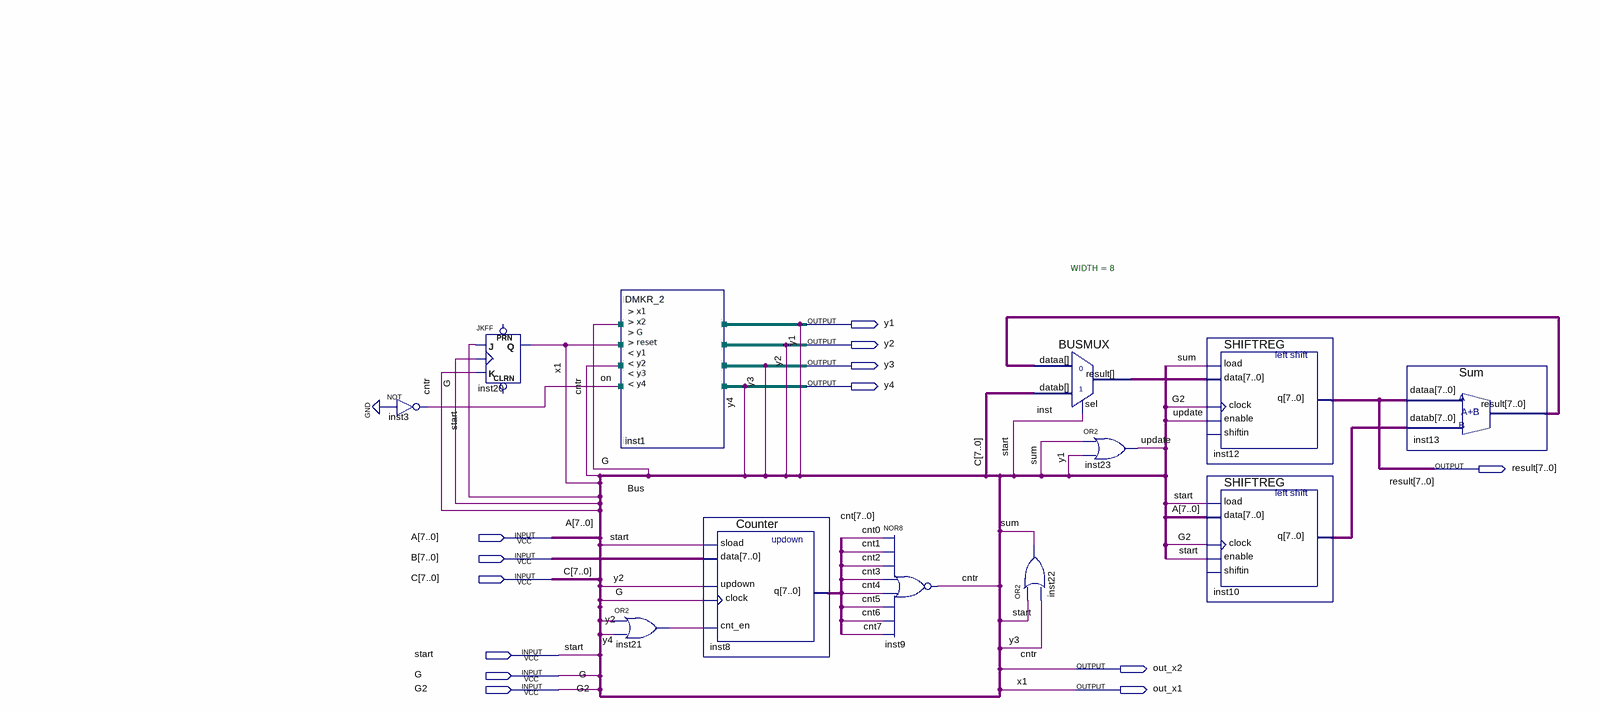
[diagram p0: schematic sheet]
// Quartus schematic DMKR_2_2.bdf as structural Verilog: 12 symbols, 13 pins
module DMKR_2_2 (
  input  [7:0] A,
  input  [7:0] B,
  input  [7:0] C,
  input  start,
  input  G,
  input  G2,
  output y1,
  output y2,
  output y3,
  output y4,
  output [7:0] result,
  output out_x2,
  output out_x1
);

  wire inst21_out, on, sum, update;
  wire [7:0] cnt, inst10_q, inst13_result, inst_result;

  not inst3 (on, 1'b0);
  JKFF inst20 (.K(out_x2), .J(start), .CLK(G), .Q(out_x1));  // open: PRN, CLRN
  or inst21 (inst21_out, y2, y4);
  DMKR_2 inst1 (.x1(out_x1), .x2(out_x2), .G(G), .reset(on), .y1(y1), .y2(y2), .y3(y3), .y4(y4));
  Counter inst8 (.sload(start), .data(B), .updown(y2), .clock(G), .cnt_en(inst21_out), .q(cnt));
  nor inst9 (out_x2, cnt[0], cnt[1], cnt[2], cnt[3], cnt[4], cnt[5], cnt[6], cnt[7]);
  BUSMUX #(.WIDTH(8)) inst (.datab(C), .sel(start), .dataa(inst13_result), .result(inst_result));
  or inst22 (sum, start, y3);
  or inst23 (update, sum, y1);
  SHIFTREG inst12 (.load(sum), .data(inst_result), .clock(G2), .enable(update), .q(result));  // open: shiftin
  SHIFTREG inst10 (.load(start), .data(A), .clock(G2), .enable(start), .q(inst10_q));  // open: shiftin
  Sum inst13 (.dataa(result), .datab(inst10_q), .result(inst13_result));

  // Other names for the same wires on the sheet: cntr = out_x2; x1 = out_x1
endmodule
